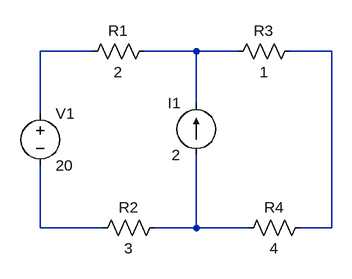
[diagram p0: schematic Draft5.asc]
Draft5.asc, the LTspice schematic file:
Version 4
SHEET 1 880 680
WIRE 144 48 64 48
WIRE 304 48 224 48
WIRE 368 48 304 48
WIRE 512 48 448 48
WIRE 304 128 304 48
WIRE 64 144 64 48
WIRE 64 320 64 224
WIRE 160 320 64 320
WIRE 304 320 304 208
WIRE 304 320 240 320
WIRE 384 320 304 320
WIRE 512 320 512 48
WIRE 512 320 464 320
SYMBOL voltage 64 128 R0
SYMATTR InstName V1
SYMATTR Value 20
SYMBOL res 240 32 R90
WINDOW 0 0 56 VBottom 2
WINDOW 3 32 56 VTop 2
SYMATTR InstName R1
SYMATTR Value 2
SYMBOL res 256 304 R90
WINDOW 0 0 56 VBottom 2
WINDOW 3 32 56 VTop 2
SYMATTR InstName R2
SYMATTR Value 3
SYMBOL res 464 32 R90
WINDOW 0 0 56 VBottom 2
WINDOW 3 32 56 VTop 2
SYMATTR InstName R3
SYMATTR Value 1
SYMBOL res 480 304 R90
WINDOW 0 0 56 VBottom 2
WINDOW 3 32 56 VTop 2
SYMATTR InstName R4
SYMATTR Value 4
SYMBOL current 304 208 R180
WINDOW 0 24 80 Left 2
WINDOW 3 24 0 Left 2
SYMATTR InstName I1
SYMATTR Value 2

The netlist it stands for:
* Draft5.asc
V1 N001 N004 20
R1 N002 N001 2
R2 N005 N004 3
R3 N003 N002 1
R4 N003 N005 4
I1 N005 N002 2
.backanno
.end